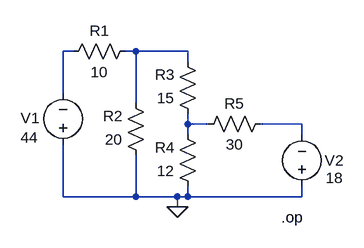
[diagram p0: schematic ThreeLoop.asc]
ThreeLoop.asc, the LTspice schematic file:
Version 4
SHEET 1 880 680
WIRE 160 192 144 192
WIRE 256 192 240 192
WIRE 336 192 256 192
WIRE 336 208 336 192
WIRE 144 256 144 192
WIRE 256 272 256 192
WIRE 336 304 336 288
WIRE 368 304 336 304
WIRE 512 304 448 304
WIRE 336 320 336 304
WIRE 512 320 512 304
WIRE 144 416 144 336
WIRE 256 416 256 352
WIRE 256 416 144 416
WIRE 320 416 256 416
WIRE 336 416 336 400
WIRE 336 416 320 416
WIRE 512 416 512 400
WIRE 512 416 336 416
WIRE 320 432 320 416
FLAG 320 432 0
SYMBOL res 256 176 R90
WINDOW 0 0 56 VBottom 0
WINDOW 3 32 56 VTop 0
SYMATTR InstName R1
SYMATTR Value 10
SYMBOL res 272 368 R180
WINDOW 0 36 76 Left 0
WINDOW 3 36 40 Left 0
SYMATTR InstName R2
SYMATTR Value 20
SYMBOL res 352 304 R180
WINDOW 0 36 76 Left 0
WINDOW 3 36 40 Left 0
SYMATTR InstName R3
SYMATTR Value 15
SYMBOL res 352 416 R180
WINDOW 0 36 76 Left 0
WINDOW 3 36 40 Left 0
SYMATTR InstName R4
SYMATTR Value 12
SYMBOL res 352 320 R270
WINDOW 0 32 56 VTop 0
WINDOW 3 0 56 VBottom 0
SYMATTR InstName R5
SYMATTR Value 30
SYMBOL voltage 144 352 R180
WINDOW 0 36 57 Left 0
WINDOW 3 38 27 Left 0
WINDOW 123 0 0 Left 0
WINDOW 39 0 0 Left 0
SYMATTR InstName V1
SYMATTR Value 44
SYMBOL voltage 512 416 R180
WINDOW 0 -64 56 Left 0
WINDOW 3 -64 29 Left 0
WINDOW 123 0 0 Left 0
WINDOW 39 0 0 Left 0
SYMATTR InstName V2
SYMATTR Value 18
TEXT 480 448 Left 0 !.op

The netlist it stands for:
* ThreeLoop.asc
R1 N002 N001 10
R2 0 N002 20
R3 N003 N002 15
R4 0 N003 12
R5 N003 N004 30
V1 0 N001 44
V2 0 N004 18
.op
.backanno
.end